# EAGLE design Adafruit 1.8 TFTshield rev B (EAGLE 9.0.1)
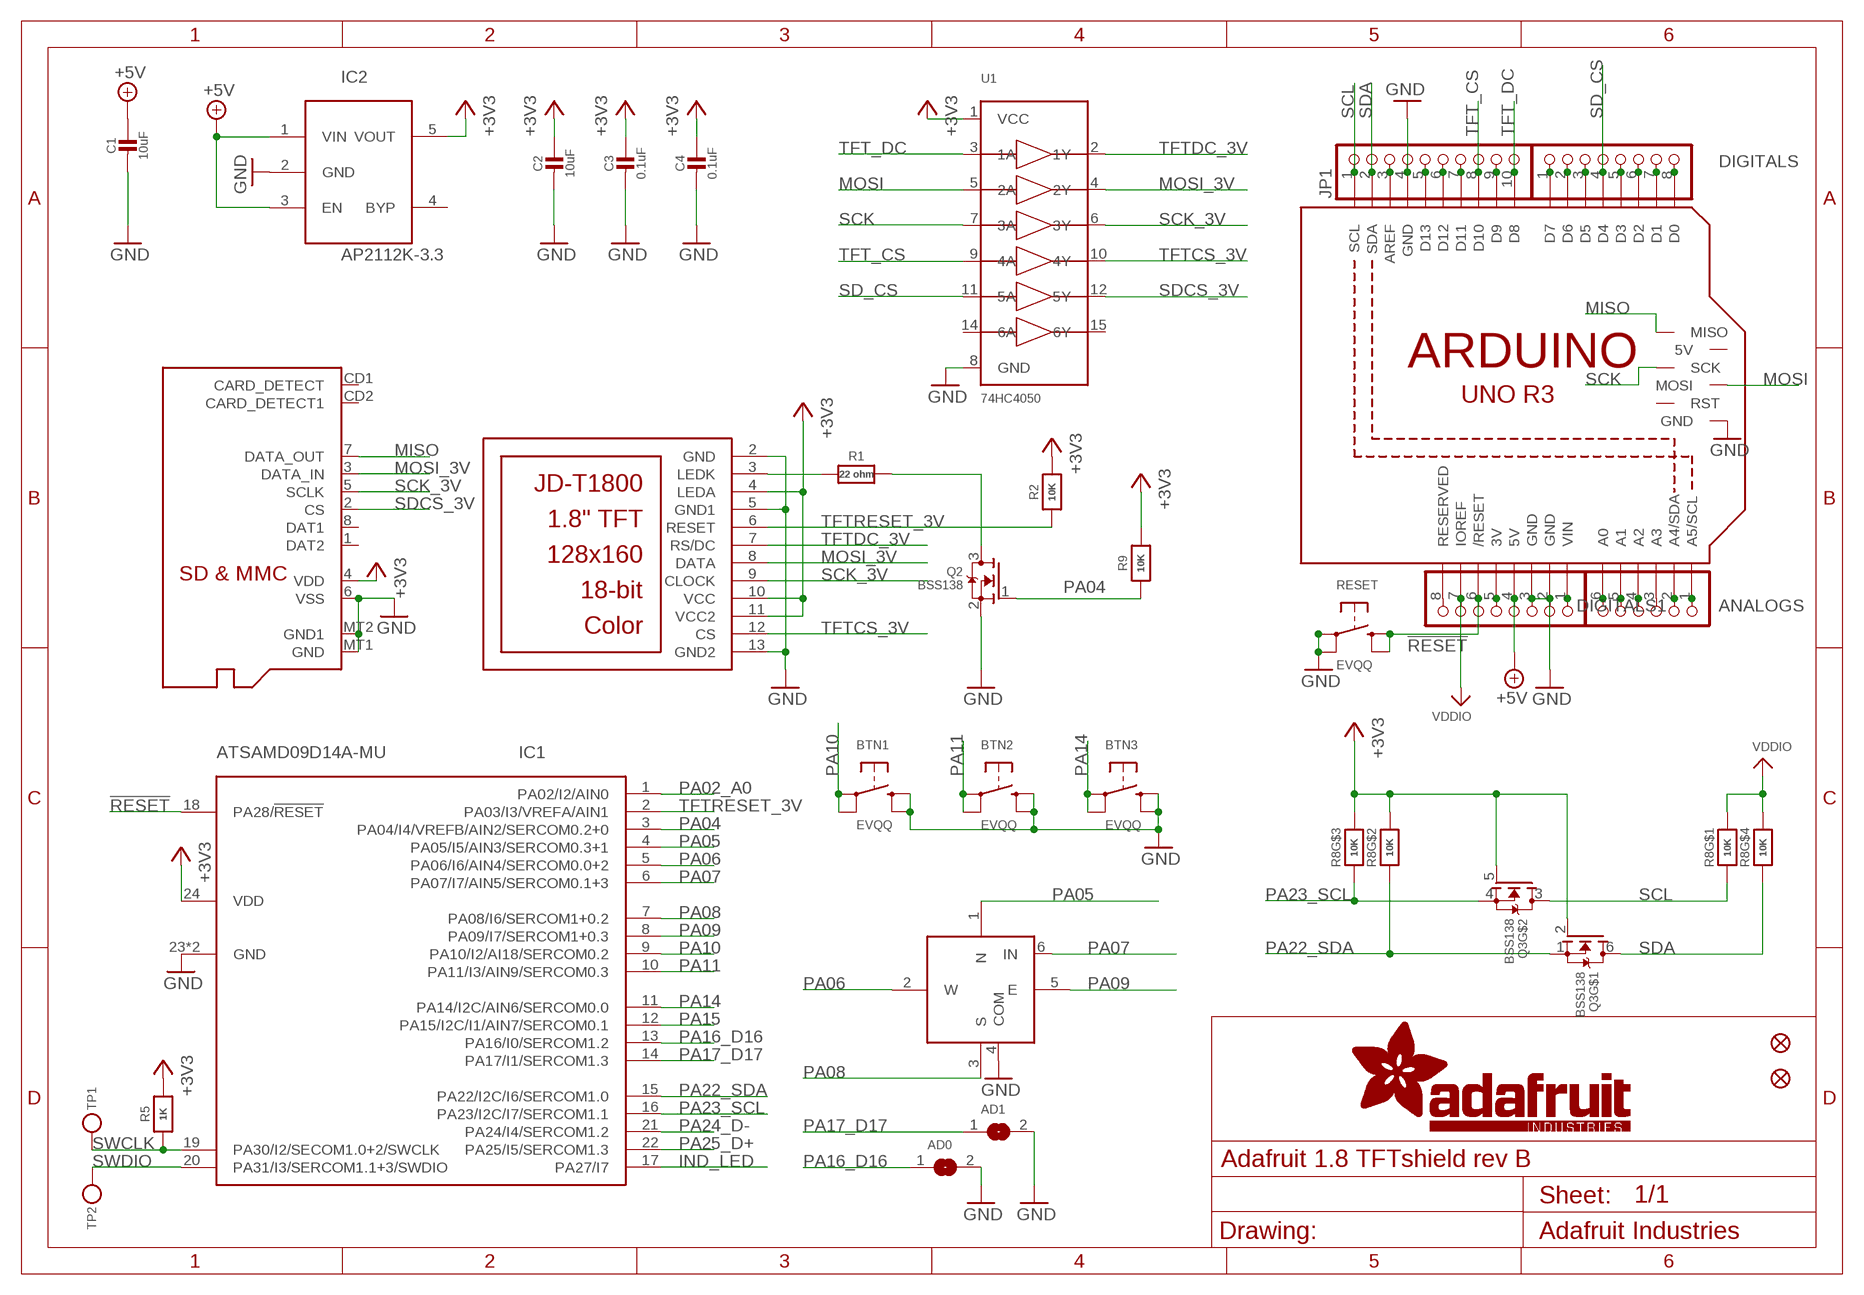
[diagram p0: schematic, sheet 1]

## Parts
AD0  SOLDERJUMPER  [SOLDERJUMPER_ARROW_NOPASTE]
AD1  SOLDERJUMPER  [SOLDERJUMPER_ARROW_NOPASTE]
ANALOGS  HEADER-1X6ROUND  [1X06_ROUND]
BTN1  EVQQ  SWITCH_TACT_SMT_EVQQ2_SMALL  [EVQ-Q2_SMALLER]
BTN2  EVQQ  SWITCH_TACT_SMT_EVQQ2_SMALL  [EVQ-Q2_SMALLER]
BTN3  EVQQ  SWITCH_TACT_SMT_EVQQ2_SMALL  [EVQ-Q2_SMALLER]
C1  10uF  CAP_CERAMIC0805-NOOUTLINE  [0805-NO]
C2  10uF  CAP_CERAMIC0805-NOOUTLINE  [0805-NO]
C3  0.1uF  CAP_CERAMIC0805-NOOUTLINE  [0805-NO]
C4  0.1uF  CAP_CERAMIC0805-NOOUTLINE  [0805-NO]
DIGITALS  HEADER-1X8ROUND  [1X08_ROUND]
DIGITALS1  HEADER-1X8ROUND  [1X08_ROUND]
FID1  FIDUCIAL_1MM  [FIDUCIAL_1MM]
FID3  FIDUCIAL_1MM  [FIDUCIAL_1MM]
IC1  ATSAMD09D14A-MU  [QFN24_4MM]
IC2  AP2112K-3.3  LP298XS  [SOT23-5L]
JP1  HEADER-1X10ROUND  [1X10_ROUND]
M1  ARDUINO_R3_ICSP  [ARDUINOR3_ICSP]
Q2  BSS138  MOSFET-NWIDE  [SOT23-WIDE]
Q3  BSS138  MOSFET-N_DUAL  [SOT363]
R1  22 ohm  RESISTOR0805_NOOUTLINE  [0805-NO]
R2  10K  RESISTOR0805_NOOUTLINE  [0805-NO]
R5  1K  RESISTOR0805_NOOUTLINE  [0805-NO]
R8  10K  RESISTOR_4PACK_NO  [RESPACK_4X0603_NO]
R9  10K  RESISTOR0805_NOOUTLINE  [0805-NO]
RESET  EVQQ  SWITCH_TACT_SMT_EVQQ2_SMALL  [EVQ-Q2_SMALLER]
SW1  NAVSWITCHSKQUABAUE010  [SKQUBAE010]
TP1  TESTPOINTROUND2MM  [TESTPOINT_ROUND_2MM]
TP2  TESTPOINTROUND2MM  [TESTPOINT_ROUND_2MM]
U1  74HC4050  74HC4050DTSSOP  [TSSOP16]
U$1  DISP_LCD_JDT1800  [JD-T1800]
U$3  MICROSD  [MICROSD]

## Nets
!RESET: DIGITALS1.6 IC1.18(PA28/!RESET) M1.RESET(/RESET) RESET.B'(S1) RESET.B(S)
+3.3V: DIGITALS1.5 M1.3V
+3V3 [power]: C2.1 C3.1 C4.1 IC1.24(VDD) IC2.5(VOUT) Q3.2(G) Q3.5(G) R2.2 R5.2 R8.6 R8.7 R9.2 U1.1(VCC) U$1.4(LEDA) U$1.10(VCC) U$1.11(VCC2) U$3.4(VDD)
+5V [power]: C1.1 DIGITALS1.4 IC2.1(VIN) IC2.3(EN) M1.5V
A0: ANALOGS.6 M1.A0
A1: ANALOGS.5 M1.A1
A2: ANALOGS.4 M1.A2
A4: ANALOGS.2 M1.A4(A4/SDA)
A5: ANALOGS.1 M1.A5(A5/SCL)
AREF: JP1.3 M1.AREF
D0: DIGITALS.8 M1.D0
D1: DIGITALS.7 M1.D1
D2: DIGITALS.6 M1.D2
D3: DIGITALS.5 M1.D3
D5: DIGITALS.3 M1.D5
D6: DIGITALS.2 M1.D6
D7: DIGITALS.1 M1.D7
D9: JP1.9 M1.D9
GND: AD0.2 AD1.2 BTN1.B'(S1) BTN1.B(S) BTN2.B'(S1) BTN2.B(S) BTN3.B'(S1) BTN3.B(S) C1.2 C2.2 C3.2 C4.2 DIGITALS1.2 DIGITALS1.3 IC1.23(GND) IC1.THERM(GND) IC2.2(GND) JP1.4 M1.GND M1.GND@1(GND) M1.GND@2(GND) M1.GND@3(GND) Q2.2(S) RESET.A'(P1) RESET.A(P) SW1.4(COM) U1.8(GND) U$1.2(GND) U$1.5(GND1) U$1.13(GND2) U$3.6(VSS) U$3.MT1(GND) U$3.MT2(GND1)
IND_LED: IC1.17(PA27/I7)
MISO: M1.MISO U$3.7(DATA_OUT)
MOSI: M1.MOSI U1.5(2A)
MOSI_3V: U1.4(2Y) U$1.8(DATA) U$3.3(DATA_IN)
N$4: R1.1 U$1.3(LEDK)
N$5: Q2.3(D) R1.2
N$6: JP1.5 M1.D13
N$10: JP1.6 M1.D12
N$11: JP1.7 M1.D11
N$16: ANALOGS.3 M1.A3
N$18: DIGITALS1.8 M1.RESERVED
PA02_A0: IC1.1(PA02/I2/AIN0)
PA04: IC1.3(PA04/I4/VREFB/AIN2/SERCOM0.2+0) Q2.1(G) R9.1
PA05: IC1.4(PA05/I5/AIN3/SERCOM0.3+1) SW1.1(N)
PA06: IC1.5(PA06/I6/AIN4/SERCOM0.0+2) SW1.2(W)
PA07: IC1.6(PA07/I7/AIN5/SERCOM0.1+3) SW1.6(IN)
PA08: IC1.7(PA08/I6/SERCOM1+0.2) SW1.3(S)
PA09: IC1.8(PA09/I7/SERCOM1+0.3) SW1.5(E)
PA10: BTN1.A'(P1) BTN1.A(P) IC1.9(PA10/I2/AI18/SERCOM0.2)
PA11: BTN2.A'(P1) BTN2.A(P) IC1.10(PA11/I3/AIN9/SERCOM0.3)
PA14: BTN3.A'(P1) BTN3.A(P) IC1.11(PA14/I2C/AIN6/SERCOM0.0)
PA15: IC1.12(PA15/I2C/I1/AIN7/SERCOM0.1)
PA16_D16: AD0.1 IC1.13(PA16/I0/SERCOM1.2)
PA17_D17: AD1.1 IC1.14(PA17/I1/SERCOM1.3)
PA22_SDA: IC1.15(PA22/I2C/I6/SERCOM1.0) Q3.1(S) R8.2
PA23_SCL: IC1.16(PA23/I2C/I7/SERCOM1.1) Q3.4(S) R8.3
PA24_D-: IC1.21(PA24/I4/SERCOM1.2)
PA25_D+: IC1.22(PA25/I5/SERCOM1.3)
SCK: M1.SCK U1.7(3A)
SCK_3V: U1.6(3Y) U$1.9(CLOCK) U$3.5(SCLK)
SCL: JP1.1 M1.SCL Q3.3(D) R8.1
SD_CS: DIGITALS.4 M1.D4 U1.11(5A)
SDA: JP1.2 M1.SDA Q3.6(D) R8.4
SDCS_3V: U1.12(5Y) U$3.2(CS)
SWCLK: IC1.19(PA30/I2/SECOM1.0+2/SWCLK) R5.1 TP1.P$1
SWDIO: IC1.20(PA31/I3/SERCOM1.1+3/SWDIO) TP2.P$1
TFT_CS: JP1.8 M1.D10 U1.9(4A)
TFT_DC: JP1.10 M1.D8 U1.3(1A)
TFTCS_3V: U1.10(4Y) U$1.12(CS)
TFTDC_3V: U1.2(1Y) U$1.7(RS/DC)
TFTRESET_3V: IC1.2(PA03/I3/VREFA/AIN1) R2.1 U$1.6(RESET)
VDDIO: DIGITALS1.7 M1.IOREF R8.5 R8.8
VIN: DIGITALS1.1 M1.VIN
Unconnected: IC2.4(BYP) M1.5V_ICSP(5V) M1.RESET_ICSP(RST) U1.14(6A) U1.15(6Y) U$3.1(DAT2) U$3.8(DAT1) U$3.CD1(CARD_DETECT) U$3.CD2(CARD_DETECT1)

## Library data of the parts
AD0 AD1 = microbuilder:SOLDERJUMPER: SMD Solder JUMPER Solder the two pads together to create a connection, or remove the solder to break it. REFLOW - Use this footprint for solder paste and reflow ovens. WAVE - Use this footprint for hand-soldering (larger pads). CLOSED - Has a trace between the two pads to ensure it is closed by default. The trace needs to be cut to disable the jumper, and can be closed again by creating a solder bridge between the two pads.; BOM: EXCLUDE
ANALOGS = microbuilder:HEADER-1X6: PIN HEADER
BTN1-BTN3 RESET = microbuilder:SWITCH_TACT_SMT: SMT Tact Switches 6x6mm - Digikey: P12940SCT-ND KMR2 (4.6x2.8mm) - Digikey: 401-1426-1-ND EVQ-PQHB55 - Light Touch, 160GF (4.5x4.5mm) - Digikey: P8090SCT-ND KMT0 - KMT021 NGJ LHS (etc.) IP68/Waterproof - Digikey: CKN10289CT-ND
C1-C4 = microbuilder:CAP_CERAMIC: Ceramic Capacitors For new designs, use the packages preceded by an '_' character since they are more reliable: The following footprints should be used on most boards: _0402 - Standard footprint for regular board layouts _0603 - Standard footprint for regular board layouts _0805 - Standard footprint for regular board layouts _1206 - Standard footprint for regular board layouts For extremely tight-pitch boards where space is at a premium, the following 'micro-pitch' footprints can be used (smaller pads, no silkscreen outline, etc.): _0402MP - Micro-pitch footprint for very dense/compact boards _0603MP - Micro-pitch footprint for very dense/compact boards _0805MP - Micro-pitch footprint for very dense/compact boards _1206MP - Micro-pitch footprint for very dense/compact boards
DIGITALS DIGITALS1 = microbuilder:HEADER-1X8: PIN HEADER
FID1 FID3 = microbuilder:FIDUCIAL: Fiducial Alignment Points Various fiducial points for machine vision alignment.; BOM: EXCLUDE
IC1 = microbuilder:ATSAMD09D14A
IC2 = adafruit:LP298X
JP1 = microbuilder:HEADER-1X10: PIN HEADER
M1 = adafruit:ARDUINO_R3_ICSP
Q2 = microbuilder:MOSFET-N: N-Channel Mosfet LEGEND VDS: Voltage Drain-Source ID: Drain Current RDS(ON): Drain-Source On-State Resistance VGS(TH): Gate-Source Threshold Voltage CISS: Drain-Source Input Capacitance SOT-23 Name VDS ID RDS(ON) VGS(TH) CISS Order Number 2N7002E 60V 260mA 2.5 Ohm 2.5V @ 250uA 26.7pF @ 25V 2N7002ET1GOSTR-ND BSH103 30V 850mA 400 mOhm 400mV @ 1mA 83pF @ 24V BSH103,235-ND BSS138 60V 320mA 1.6 Ohm 1.5V @ 250uA 50pF @ 10V Mouser: 771-BSS138PW115 DMN2075U-7 20V 4.2A 38 mOhm 1V @ 250 uA 594.3pF @ 10V DMN2075U-7DICT-ND * BSS138 good choice for I2C level-shifting POWERPAK 1212-8 Name VDS ID RDS(ON) VGS(TH) CISS Order Number Si7308DN 60V 6A 58 mOhm 3V @ 250uA 665pF @ 15V SI7308DN-T1-E3CT-ND
Q3 = microbuilder:MOSFET-N_DUAL: Dual N-Channel MOSFET SOT363 (2.0x1.25mm) 2N7002PS - 60V, 320mA [Digikey: 568-5984-1-ND]
R1 R2 R5 R9 = microbuilder:RESISTOR: Resistors For new designs, use the packages preceded by an '_' character since they are more reliable: The following footprints should be used on most boards: _0402 - Standard footprint for regular board layouts _0603 - Standard footprint for regular board layouts _0805 - Standard footprint for regular board layouts _1206 - Standard footprint for regular board layouts For extremely tight-pitch boards where space is at a premium, the following 'micro-pitch' footprints can be used (smaller pads, no silkscreen outline, etc.): _0402MP - Micro-pitch footprint for very dense/compact boards _0603MP - Micro-pitch footprint for very dense/compact boards _0805MP - Micro-pitch footprint for very dense/compact boards _1206MP - Micro-pitch footprint for very dense/compact boards
R8 = microbuilder:RESISTOR_4PACK: Resistor Packs (4 resistors) 4 x 0603 10K 1/16W - Digikey: YC164J-10KCT-ND
SW1 = microbuilder:NAVSWITCH
TP1 TP2 = microbuilder:TESTPOINT: Test Point Various test points for characterisation and PCB testing TESTPOINT_SMT - Compact Surface Mount Test Point [Digikey: 5016KTR-ND]
U1 = microbuilder:74HC4050D: 6-channel level shifter 74HC4050D - 2V-6V Supply SOIC16 Digikey: 74HC4050D,653-ND Mouser: 771-74HC4050D-T TSSOP16 Digikey: 296-9215-1-ND Mouser:
U$1 = microbuilder:DISP_LCD_JDT1800
U$3 = adafruit:MICROSD: Micro-SD / Transflash card holder with SPI pinout For the 3M # 2908-05WB-MG and/or 4UCON #19656 push-push type

## Net classes
1 power: width 0.305 mm

## Board
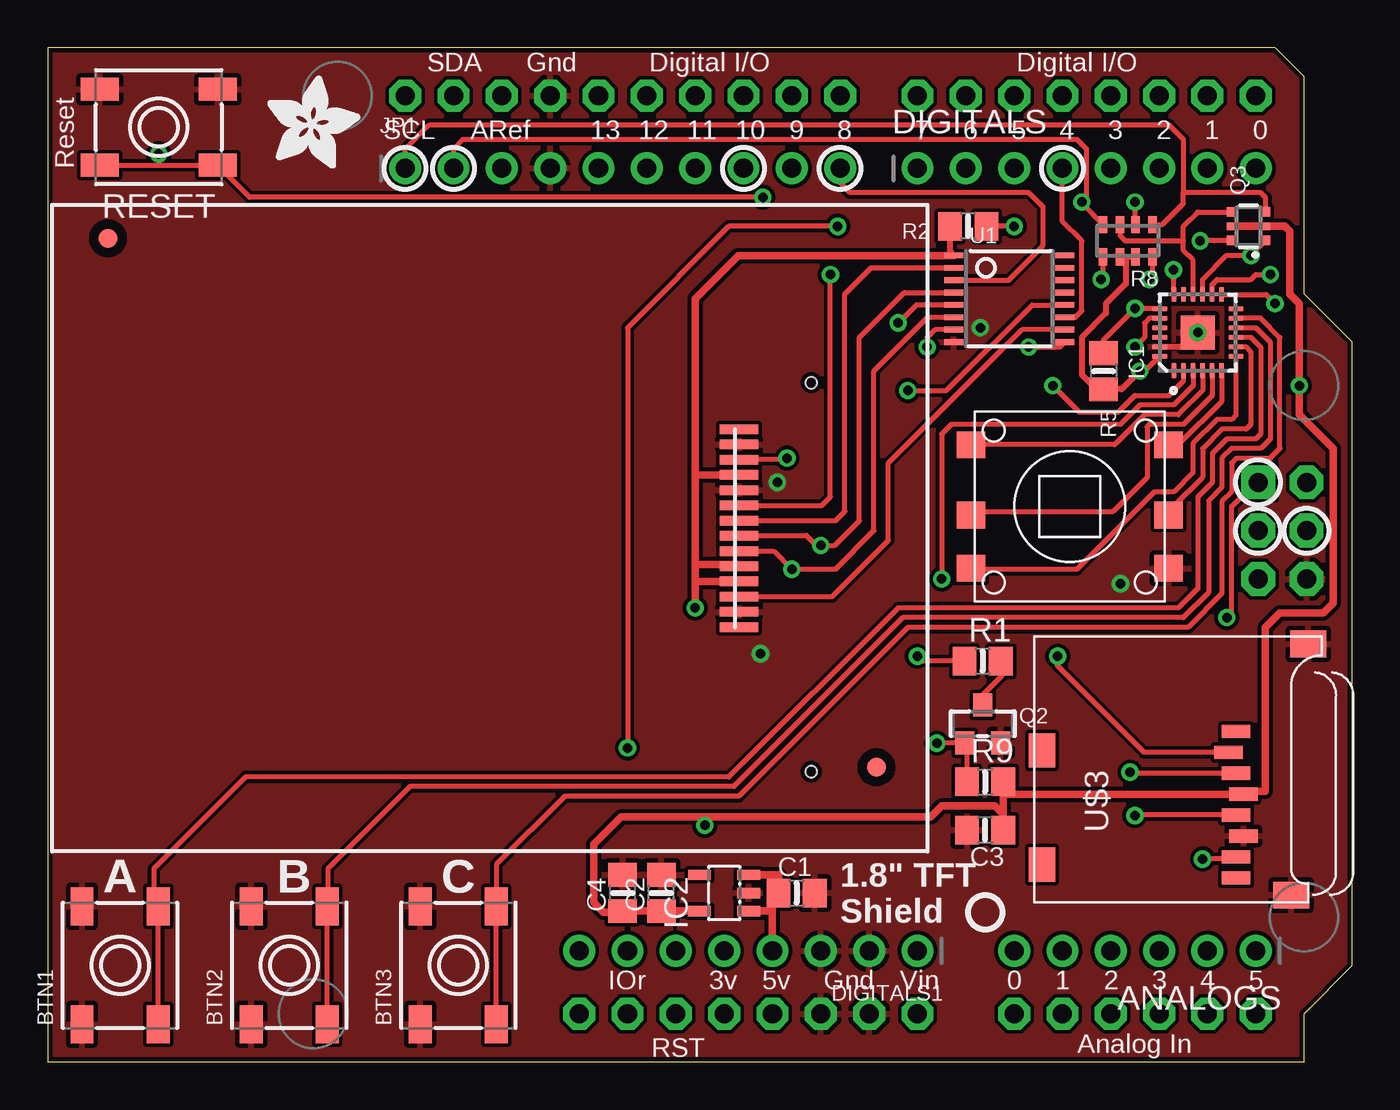
[diagram p1: board, top side]
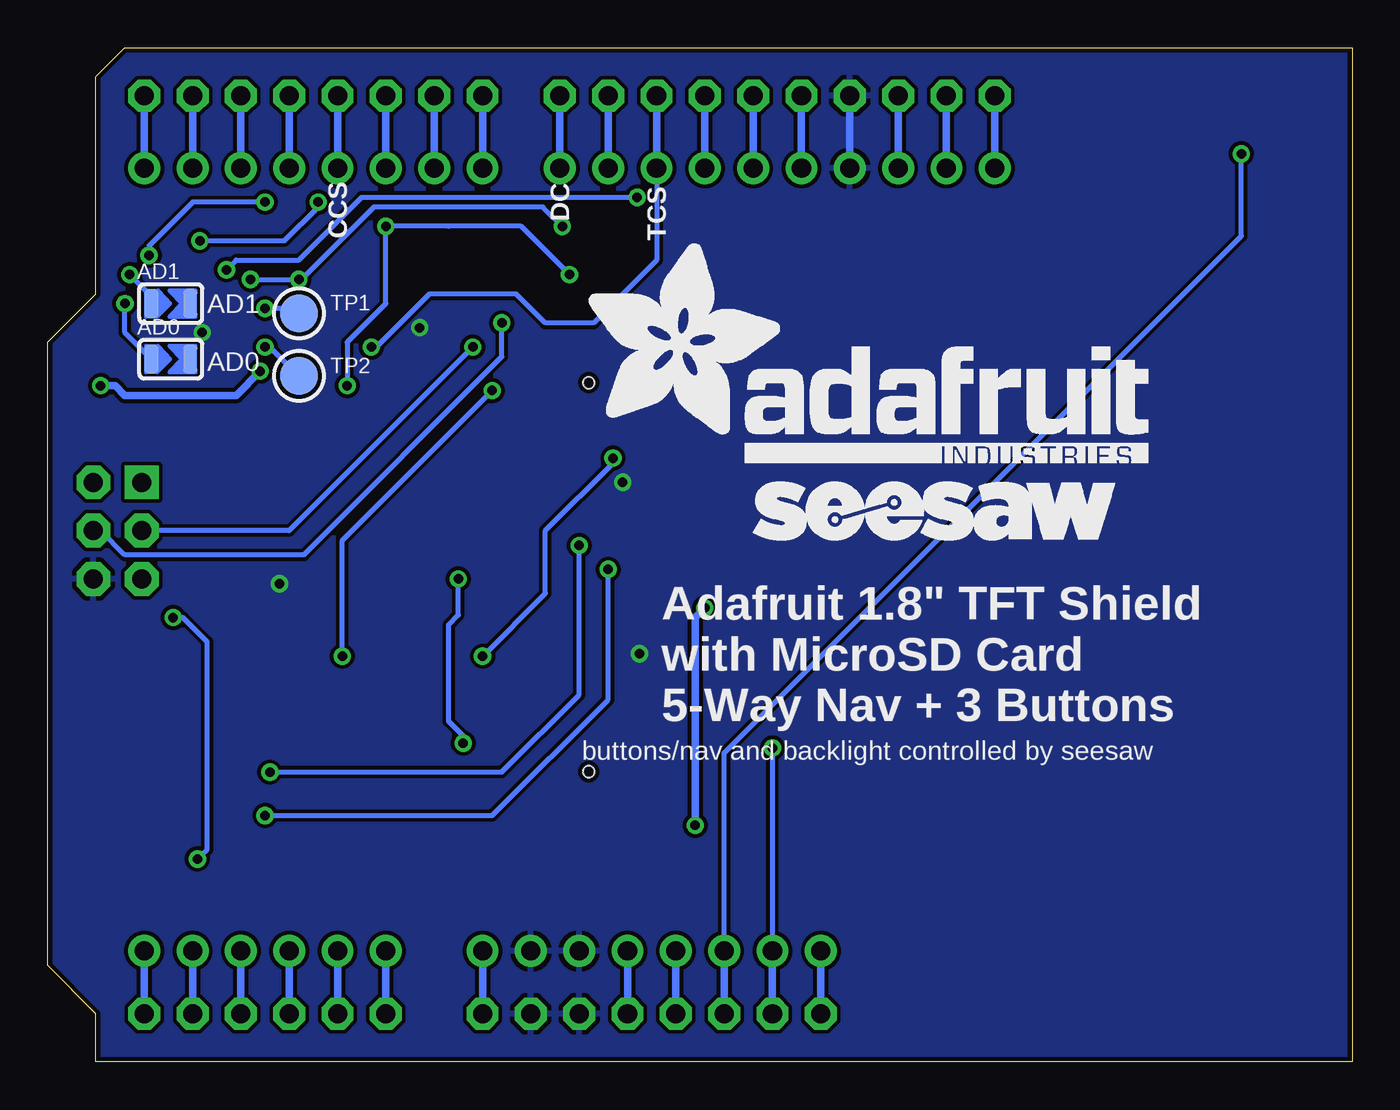
[diagram p2: board, bottom side, seen from below]

Size 68.58 x 53.34 mm. Coordinates in mm from the lower left corner, seen from the top.
Copper layers (1*16): Top 0.035mm / dielectric 1.5mm / Bottom 0.035mm
Design rules "adafruit *": minimum track width 8mil, minimum drill 15.5mil, track to track 8mil, track to pad 8mil, pad to pad 8mil, via to via 8mil, smd to smd 8mil, copper to edge 10mil, drill to drill 8mil, minimum pad ring 10mil, minimum via ring 8mil, stop-mask expansion 2mil, vias tented up to drill 20mil, thermal gap 10mil

### Footprints (pad centres in the part's own frame; a part is rotated, then mirrored left to right if it is on the bottom)
SOLDERJUMPER_ARROW_NOPASTE = smd 0.762 x 1.524: 1 -1.016,0; 2 1.016,0
1X06_ROUND = drill 1 pad 1.676: 1 -6.35,0; 2 -3.81,0; 3 -1.27,0; 4 1.27,0; 5 3.81,0; 6 6.35,0
EVQ-Q2_SMALLER = smd 2 x 1.2: A -3.1,-2; A' 3.1,-2; B -3.1,2; B' 3.1,2
0805-NO = smd 1.24 x 1.5: 1 -0.95,0; 2 0.95,0
1X08_ROUND = drill 1 pad 1.676: 1 -8.89,0; 2 -6.35,0; 3 -3.81,0; 4 -1.27,0; 5 1.27,0; 6 3.81,0; 7 6.35,0; 8 8.89,0
FIDUCIAL_1MM = smd 1 x 1: 1 0,0
QFN24_4MM = smd 0.8 x 0.28: 1 -2,1.25; 2 -2,0.75; 3 -2,0.25; 4 -2,-0.25; 5 -2,-0.75; 6 -2,-1.25; 13 2,-1.25; 14 2,-0.75; 15 2,-0.25; 16 2,0.25; 17 2,0.75; 18 2,1.25 | smd 0.28 x 0.8: 7 -1.25,-2; 8 -0.75,-2; 9 -0.25,-2; 10 0.25,-2; 11 0.75,-2; 12 1.25,-2; 19 1.25,2; 20 0.75,2; 21 0.25,2; 22 -0.25,2; 23 -0.75,2; 24 -1.25,2 | smd 1.778 x 1.778: THERM 0,0
SOT23-5L = smd 0.55 x 1.2: 1 -0.95,-1.3; 2 0,-1.3; 3 0.95,-1.3; 4 0.95,1.3; 5 -0.95,1.3
1X10_ROUND = drill 1 pad 1.676: 1 -11.43,0; 2 -8.89,0; 3 -6.35,0; 4 -3.81,0; 5 -1.27,0; 6 1.27,0; 7 3.81,0; 8 6.35,0; 9 8.89,0; 10 11.43,0
ARDUINOR3_ICSP = drill 1 pad 1.676 octagon: 3V 35.56,2.54; 5V 38.1,2.54; A0 50.8,2.54; A1 53.34,2.54; A2 55.88,2.54; A3 58.42,2.54; A4 60.96,2.54; A5 63.5,2.54; AREF 23.876,50.8; D0 63.5,50.8; D1 60.96,50.8; D2 58.42,50.8; D3 55.88,50.8; D4 53.34,50.8; D5 50.8,50.8; D6 48.26,50.8; D7 45.72,50.8; D8 41.656,50.8; D9 39.116,50.8; D10 36.576,50.8; D11 34.036,50.8; D12 31.496,50.8; D13 28.956,50.8; GND 26.416,50.8; GND@1 43.18,2.54; GND@2 40.64,2.54; IOREF 30.48,2.54; RESERVED 27.94,2.54; RESET 33.02,2.54; SCL 18.796,50.8; SDA 21.336,50.8; VIN 45.72,2.54 | drill 1 pad 1.778 octagon: 5V_ICSP 66.167,30.48; GND@3 66.167,25.4; MOSI 66.167,27.94; RESET_ICSP 63.627,25.4; SCK 63.627,27.94 | drill 1 pad 1.778 square: MISO 63.627,30.48
SOT23-WIDE = smd 1 x 1.2: 1 -0.95,-1; 2 0.95,-1; 3 0,1
SOT363 = smd 0.5 x 0.5: 1 -0.75,-0.9; 3 0.75,-0.9; 4 0.75,0.9; 6 -0.75,0.9 | smd 0.4 x 0.5: 2 0,-0.9; 5 0,0.9
RESPACK_4X0603_NO = smd 0.45 x 0.9: 1 -1.3,-0.85; 2 -0.4,-0.85; 3 0.4,-0.85; 4 1.3,-0.85; 5 1.3,0.85; 6 0.4,0.85; 7 -0.4,0.85; 8 -1.3,0.85
SKQUBAE010 = smd 1.5 x 1.4: 1 -5.2,3.25; 2 -5.2,-0.45; 3 -5.2,-3.25; 4 5.2,-3.25; 5 5.2,-0.45; 6 5.2,3.25
TESTPOINT_ROUND_2MM = smd 2 x 2: P$1 0,0
TSSOP16 = smd 0.305 x 0.991: 1 -2.275,-2.918; 2 -1.625,-2.918; 3 -0.975,-2.918; 4 -0.325,-2.918; 5 0.325,-2.918; 6 0.975,-2.918; 7 1.625,-2.918; 8 2.275,-2.918; 9 2.275,2.918; 10 1.625,2.918; 11 0.975,2.918; 12 0.325,2.918; 13 -0.325,2.918; 14 -0.975,2.918; 15 -1.625,2.918; 16 -2.275,2.918
JD-T1800 = smd 0.5 x 2: 1 5.2,-13.1; 2 4.4,-13.1; 3 3.6,-13.1; 4 2.8,-13.1; 5 2,-13.1; 6 1.2,-13.1; 7 0.4,-13.1; 8 -0.4,-13.1; 9 -1.2,-13.1; 10 -2,-13.1; 11 -2.8,-13.1; 12 -3.6,-13.1; 13 -4.4,-13.1; 14 -5.2,-13.1 | hole 0.6: -12.8,-16.9; 7.65,-16.9
MICROSD = smd 0.7 x 1.5: 1 9,-10.64; 2 7.9,-10.24; 3 6.8,-10.64; 4 5.7,-11.04; 5 4.6,-10.64; 6 3.5,-11.04; 7 2.4,-10.64; 8 1.3,-10.64 | smd 1.8 x 1.4: CD1 2,-0.44; CD2 8,-0.44 | smd 1.4 x 1.9: MT1 0.4,-13.54; MT2 13.6,-14.44

### Placement (x,y rotation side)
AD0  62.1,36.96 0 bottom
AD1  62.1,39.88 0 bottom
ANALOGS  57.15,5.84 180 top
BTN1  3.81,5.08 90 top
BTN2  12.7,5.08 90 top
BTN3  21.59,5.08 90 top
C1  39.37,8.89 0 top
C2  32.26,8.89 90 top
C3  49.28,12.19 180 top
C4  30.23,8.89 90 top
DIGITALS  54.61,46.99 0 top
DIGITALS1  36.83,5.84 180 top
FID1  3.17,43.31 0 top
FID3  43.56,15.49 0 top
IC1  60.45,38.35 90 top
IC2  35.56,8.89 90 top
JP1  30.23,46.99 0 top
M1  0,0 0 top
Q2  49.15,17.78 0 top
Q3  63.12,43.94 90 top
R1  49.15,21.08 0 top
R2  48.39,43.94 180 top
R5  55.5,36.32 270 top
R8  56.77,43.18 180 top
R9  49.28,14.73 0 top
RESET  5.84,49.15 180 top
SW1  53.72,29.21 0 top
TP1  55.37,39.37 0 bottom
TP2  55.37,36.07 0 bottom
U1  50.55,40.13 270 top
U$1  23.24,28.07 90 top
U$3  51.82,8.38 90 top
U$5  [ADAFRUIT_TEXT_30MM]  40.39,31.5 0 bottom
U$7  [ADAFRUIT_5MM]  11.56,46.99 0 top
U$8  [SEESAW_LOGO]  31.5,27.43 0 bottom
U$9  [PCBFEAT-REV-040]  49.28,7.87 0 top

### Tracks (layer width: path | path; a pad name or v marks a point on that pad's centre or on a via)
!RESET  (via drill 0.5)
  Top 0.254: RESET.B' 5.84,47.15 | 5.84,47.15 RESET.B 10.62,45.47 v37.59,45.47 | v5.84,47.75 5.84,47.15 | IC1.18 59.2,41.64 v59.18,41.66
  Bottom 0.254: DIGITALS1.6 33.02,16.26 5.84,43.43 v5.84,47.75 | v59.18,41.66 58.67,42.16 55.37,42.16 52.07,45.47 v37.59,45.47
  Bottom 0.406: M1.RESET DIGITALS1.6
+3.3V
  Bottom 0.406: M1.3V DIGITALS1.5
+3V3  (via drill 0.5)
  Top 0.254: IC1.24 57.67,36.32
  Top 0.305: R8.7 56.67,42.33 | 56.67,42.33 R8.6 56.39,42.31 | 56.67,42.33 56.67,40.92 55.63,39.88 55.63,39.37 54.36,38.1 54.36,36.13 55.12,35.37 R5.2 56.45,35.37 v57.4,36.32 57.67,36.32 | U1.1 47.44,42.6 R2.2
  Top 0.406: Q3.5 Q3.2 65.02,43.94 65.28,43.69 65.28,40.39 65.79,39.88 v65.79,35.56 65.79,34.04 67.56,32.26 67.56,24.13 67.06,23.62 64.77,23.62 64.01,22.86 64.01,14.22 63,14.22 U$3.4 50.37,14.08 50.23,14.22 R9.2 50.23,13.02 | U$1.4 34.04,30.87 | 34.04,30.87 34.04,26.16 | 34.04,26.16 36.34,26.16 U$1.10 | U$1.11 34.04,25.27 | 34.04,25.27 34.04,26.16 | U1.1 36.31,42.41 34.04,40.13 34.04,30.87 | 34.6,12.89 30.16,12.89 28.7,11.43 28.7,8.38 29.21,7.87 30.16,7.87 C4.1 C2.1 IC2.5 | 34.6,12.89 46.42,12.89 46.99,13.46 49.78,13.46 50.23,13.02 | 34.6,12.89 34.6,12.51 v34.54,12.45 | v34.04,23.88 34.04,25.27 | 50.23,13.02 C3.1
  Bottom 0.406: v57.4,36.32 58.67,35.05 64.52,35.05 65.02,35.56 v65.79,35.56 | v34.54,12.45 34.54,23.37 v34.04,23.88
+5V
  Top 0.406: DIGITALS1.4 38.1,7.87 38.1,7.94 | 38.1,7.94 38.1,8.57 C1.1 38.42,9.84 IC2.3 | IC2.1 38.1,7.94
  Bottom 0.406: DIGITALS1.4 M1.5V
A0
  Bottom 0.406: ANALOGS.6 M1.A0
A1
  Bottom 0.406: M1.A1 ANALOGS.5
A2
  Bottom 0.406: ANALOGS.4 M1.A2
A4
  Bottom 0.406: ANALOGS.2 M1.A4
A5
  Bottom 0.406: M1.A5 ANALOGS.1
AREF
  Bottom 0.406: M1.AREF JP1.3
D0
  Bottom 0.406: M1.D0 DIGITALS.8
D1
  Bottom 0.406: M1.D1 DIGITALS.7
D2
  Bottom 0.406: DIGITALS.6 M1.D2
D3
  Bottom 0.406: M1.D3 DIGITALS.5
D5
  Bottom 0.406: M1.D5 DIGITALS.3
D6
  Bottom 0.406: DIGITALS.2 M1.D6
D7
  Bottom 0.406: M1.D7 DIGITALS.1
D9
  Bottom 0.406: M1.D9 JP1.9
GND  (via drill 0.5)
  Top 0.305: IC1.23 60.45,37.6 IC1.THERM
  Bottom 0.406: M1.GND JP1.4
  other vias: 56.39,25.15 49.02,38.61 60.45,38.35 38.35,30.48 37.47,21.46
  pour Bottom: 0,53.34 0,0 68.58,0 68.58,53.34
  pour Top: 0,53.34 0,0 68.58,0 68.58,53.34
MISO  (via drill 0.5)
  Top 0.254: U$3.7 62.34,10.67 v60.71,10.67 | v61.98,23.37 62.23,23.62 62.23,29.21 63.5,30.48 M1.MISO
  Bottom 0.254: v60.71,10.67 60.2,11.18 60.2,22.1 61.47,23.37 v61.98,23.37
MOSI  (via drill 0.5)
  Top 0.254: U1.5 45.65,39.81 v44.7,38.86
  Bottom 0.254: M1.MOSI 65.79,27.94 64.52,26.67 55.12,26.67 44.7,37.08 v44.7,38.86
MOSI_3V  (via drill 0.5)
  Top 0.254: U$1.8 36.32,27.69 39.88,27.69 40.41,27.16 v40.64,27.16 41.38,27.16 42.67,28.45 42.67,38.1 45.03,40.46 U1.4 | U$3.3 56.95,15.18 v56.9,15.24
  Bottom 0.254: v56.9,15.24 44.7,15.24 40.64,19.3 v40.64,27.16
N$4  (via drill 0.5)
  Top 0.254: R1.1 45.97,21.08 v45.72,21.34 | v38.86,31.75 38.78,31.67 U$1.3
  Bottom 0.254: v45.72,21.34 42.42,24.64 42.42,27.94 38.86,31.5 v38.86,31.75
N$5
  Top 0.254: Q2.3 49.15,19.3 50.16,20.32 50.16,21.02 R1.2
N$6
  Bottom 0.406: M1.D13 JP1.5
N$10
  Bottom 0.406: M1.D12 JP1.6
N$11
  Bottom 0.406: M1.D11 JP1.7
N$16
  Bottom 0.406: M1.A3 ANALOGS.3
N$18
  Bottom 0.406: M1.RESERVED DIGITALS1.8
PA04  (via drill 0.5)
  Top 0.254: R9.1 48.33,16.65 Q2.1 48.18,16.76 v46.74,16.76 | IC1.3 60.2,35.56 59.18,34.54 57.4,34.54 56.39,33.53 47.5,33.53 46.99,33.02 v46.99,25.4 46.99,25.15
  Bottom 0.254: v46.74,16.76 46.74,17.14 47.5,17.91 47.5,22.99 46.99,23.5 v46.99,25.4
PA05
  Top 0.254: IC1.4 60.7,35.3 59.44,34.04 57.66,34.04 56.08,32.46 SW1.1
PA06
  Top 0.254: SW1.2 48.72,28.96 56.01,28.96 57.78,30.73 57.78,33.4 57.91,33.53 59.69,33.53 61.2,35.04 IC1.5
PA07
  Top 0.254: IC1.6 61.7,34.73 59.43,32.46 SW1.6
PA08
  Top 0.254: IC1.7 62.45,34 62.23,33.78 61.47,33.78 60.2,32.51 60.2,30.99 59.18,29.97 58.17,29.97 54.1,25.91 48.57,25.91 SW1.3
PA09
  Top 0.254: IC1.8 62.98,37.6 63.25,37.34 63.25,33.53 62.99,33.27 61.72,33.27 60.71,32.26 60.71,30.73 59.17,29.2 59.17,29.01 SW1.5 59.49,28.76
PA10
  Top 0.254: IC1.9 63.24,38.1 63.75,37.59 63.75,33.02 63.5,32.77 61.98,32.77 61.21,32 61.21,30.48 60.45,29.72 60.45,24.89 59.44,23.88 44.7,23.88 35.81,14.99 10.41,14.99 5.59,10.16 5.59,8.4 BTN1.A' BTN1.A
PA11
  Top 0.254: BTN2.A BTN2.A' 14.73,8.21 14.73,10.16 19.05,14.48 36.07,14.48 44.96,23.37 59.69,23.37 61.02,24.7 61.02,29.52 61.72,30.23 61.72,31.75 62.23,32.26 63.75,32.26 64.26,32.77 64.26,37.85 63.5,38.6 IC1.10
PA14
  Top 0.254: IC1.11 62.46,39.12 63.75,39.12 64.77,38.1 64.77,32.26 64.26,31.75 62.48,31.75 62.23,31.5 62.23,29.97 61.72,29.46 61.72,24.64 59.94,22.86 45.21,22.86 36.32,13.97 27.18,13.97 23.59,10.38 BTN3.A' BTN3.A
PA16_D16  (via drill 0.5)
  Top 0.254: IC1.13 64.04,40.35 v64.52,39.88
  Bottom 0.254: AD0.1 64.52,38.35 v64.52,39.88
PA17_D17  (via drill 0.5)
  Top 0.254: IC1.14 61.2,40.88 61.47,41.15 63.25,41.15 63.5,41.4 v64.26,41.4
  Bottom 0.254: AD1.1 63.12,40.26 v64.26,41.4
PA22_SDA  (via drill 0.5)
  Top 0.254: IC1.15 60.7,41.14 61.98,42.42 v63.25,42.42 Q3.1 | R8.2 57.17,45.19 v57.15,45.21
  Bottom 0.254: v57.15,45.21 60.96,45.21 63.25,42.93 v63.25,42.42
PA23_SCL
  Top 0.254: IC1.16 60.2,42.16 59.69,42.67 59.69,43.18 | 59.69,43.18 59.69,43.94 60.44,44.69 Q3.4 | R8.3 56.37,43.45 56.64,43.18 59.69,43.18
SCK  (via drill 0.5)
  Top 0.254: U1.7 46.63,38.51 46.23,38.1 v46.23,37.59
  Bottom 0.254: v46.23,37.59 55.88,27.94 M1.SCK
SCK_3V  (via drill 0.5)
  Top 0.254: U1.6 46.27,39.16 43.43,36.32 43.43,27.94 41.4,25.91 v39.12,25.91 38.16,26.87 U$1.9 | U$3.5 57.18,12.98 v57.15,12.95
  Bottom 0.254: v57.15,12.95 45.21,12.95 39.12,19.05 v39.12,25.91
SCL
  Top 0.254: JP1.1 18.8,48.01 20.07,49.28 58.93,49.28 59.69,48.51 59.69,45.72 | 59.69,45.72 59.69,45.14 58.58,44.03 R8.1 | Q3.3 64.02,45.45 63.75,45.72 59.69,45.72
  Bottom 0.406: M1.SCL JP1.1
SD_CS
  Top 0.254: DIGITALS.4 53.34,44.2 54.36,43.18 54.36,39.5 54.02,39.16 U1.11
  Bottom 0.406: DIGITALS.4 M1.D4
SDA  (via drill 0.5)
  Top 0.254: JP1.2 21.34,48.01 21.84,48.51 54.1,48.51 54.61,48.01 54.61,45.47 v54.36,45.21 54.32,45.18 R8.4 | Q3.6 61.34,43.19 | 61.34,43.19 61.2,43.19 | 61.34,43.19 61.33,43.18 v60.58,43.18
  Bottom 0.254: v60.58,43.18 56.13,43.18 54.36,44.96 v54.36,45.21
  Bottom 0.406: M1.SDA JP1.2
SDCS_3V  (via drill 0.5)
  Top 0.254: U$3.2 57.63,16.28 53.09,20.83 v53.09,21.34 | v45.21,35.31 47.24,35.31 51.74,39.81 U1.12
  Bottom 0.254: v53.09,21.34 53.09,27.43 v45.21,35.31
SWCLK  (via drill 0.5)
  Top 0.254: 58.43,39.62 IC1.19 57.17,39.6 v57.15,39.62 55.5,37.97 R5.1
  Bottom 0.254: TP1.P$1 55.63,39.62 v57.15,39.62
SWDIO  (via drill 0.5)
  Top 0.254: IC1.20 57.9,39.1 57.66,38.86 57.66,38.1 v57.15,37.59
  Bottom 0.254: TP2.P$1 56.9,37.59 v57.15,37.59
TFT_CS  (via drill 0.5)
  Top 0.254: v51.56,37.59 53.2,37.59 U1.9
  Bottom 0.254: JP1.8 36.58,42.16 39.88,38.86 42.42,38.86 43.94,40.39 48.51,40.39 51.31,37.59 v51.56,37.59
  Bottom 0.406: M1.D10 JP1.8
TFT_DC
  Top 0.254: U1.3 50.51,41.11 52.32,42.93 52.32,44.96 51.56,45.72 42.16,45.72 41.66,46.23 JP1.10
  Bottom 0.406: M1.D8 JP1.10
TFTCS_3V
  Top 0.254: U$1.12 41.23,24.47 44.2,27.43 44.2,31.5 51.21,38.51 U1.10
TFTDC_3V
  Top 0.254: U$1.7 41.42,28.47 41.91,28.96 41.91,40.39 43.28,41.76 46.08,41.76 46.48,41.76 U1.2
TFTRESET_3V  (via drill 0.5)
  Top 0.254: U$1.6 40.7,29.27 41.15,29.72 v41.15,41.4 | v50.8,43.94 R2.1 | v52.83,35.56 54.23,34.16 56.26,34.16 57.15,35.05 58.93,35.05 59.7,35.83 IC1.2
  Bottom 0.254: v41.15,41.4 43.69,43.94 47.5,43.94 v50.8,43.94 50.8,39.88 52.83,37.85 v52.83,35.56
VDDIO  (via drill 0.5)
  Top 0.254: R8.8 58.07,41.3 v57.91,41.15 | v41.53,43.94 35.81,43.94 30.48,38.61 v30.48,16.51 | v55.37,41.15 55.47,41.24 R8.5
  Bottom 0.254: v57.91,41.15 v55.37,41.15 55.24,41.15 51.44,44.96 42.55,44.96 v41.53,43.94 | v30.48,16.51 DIGITALS1.7
  Bottom 0.406: M1.IOREF DIGITALS1.7
VIN
  Bottom 0.406: DIGITALS1.1 M1.VIN

### Text on the board
tPlace: Reset | A | B | C | 1.8" TFT / Shield
bPlace: DC | TCS | CCS | AD1 | AD0 | Adafruit 1.8" TFT Shield / with MicroSD Card / 5-Way Nav + 3 Buttons | buttons/nav and backlight controlled by seesaw